# Altium project Project.PrjPCB
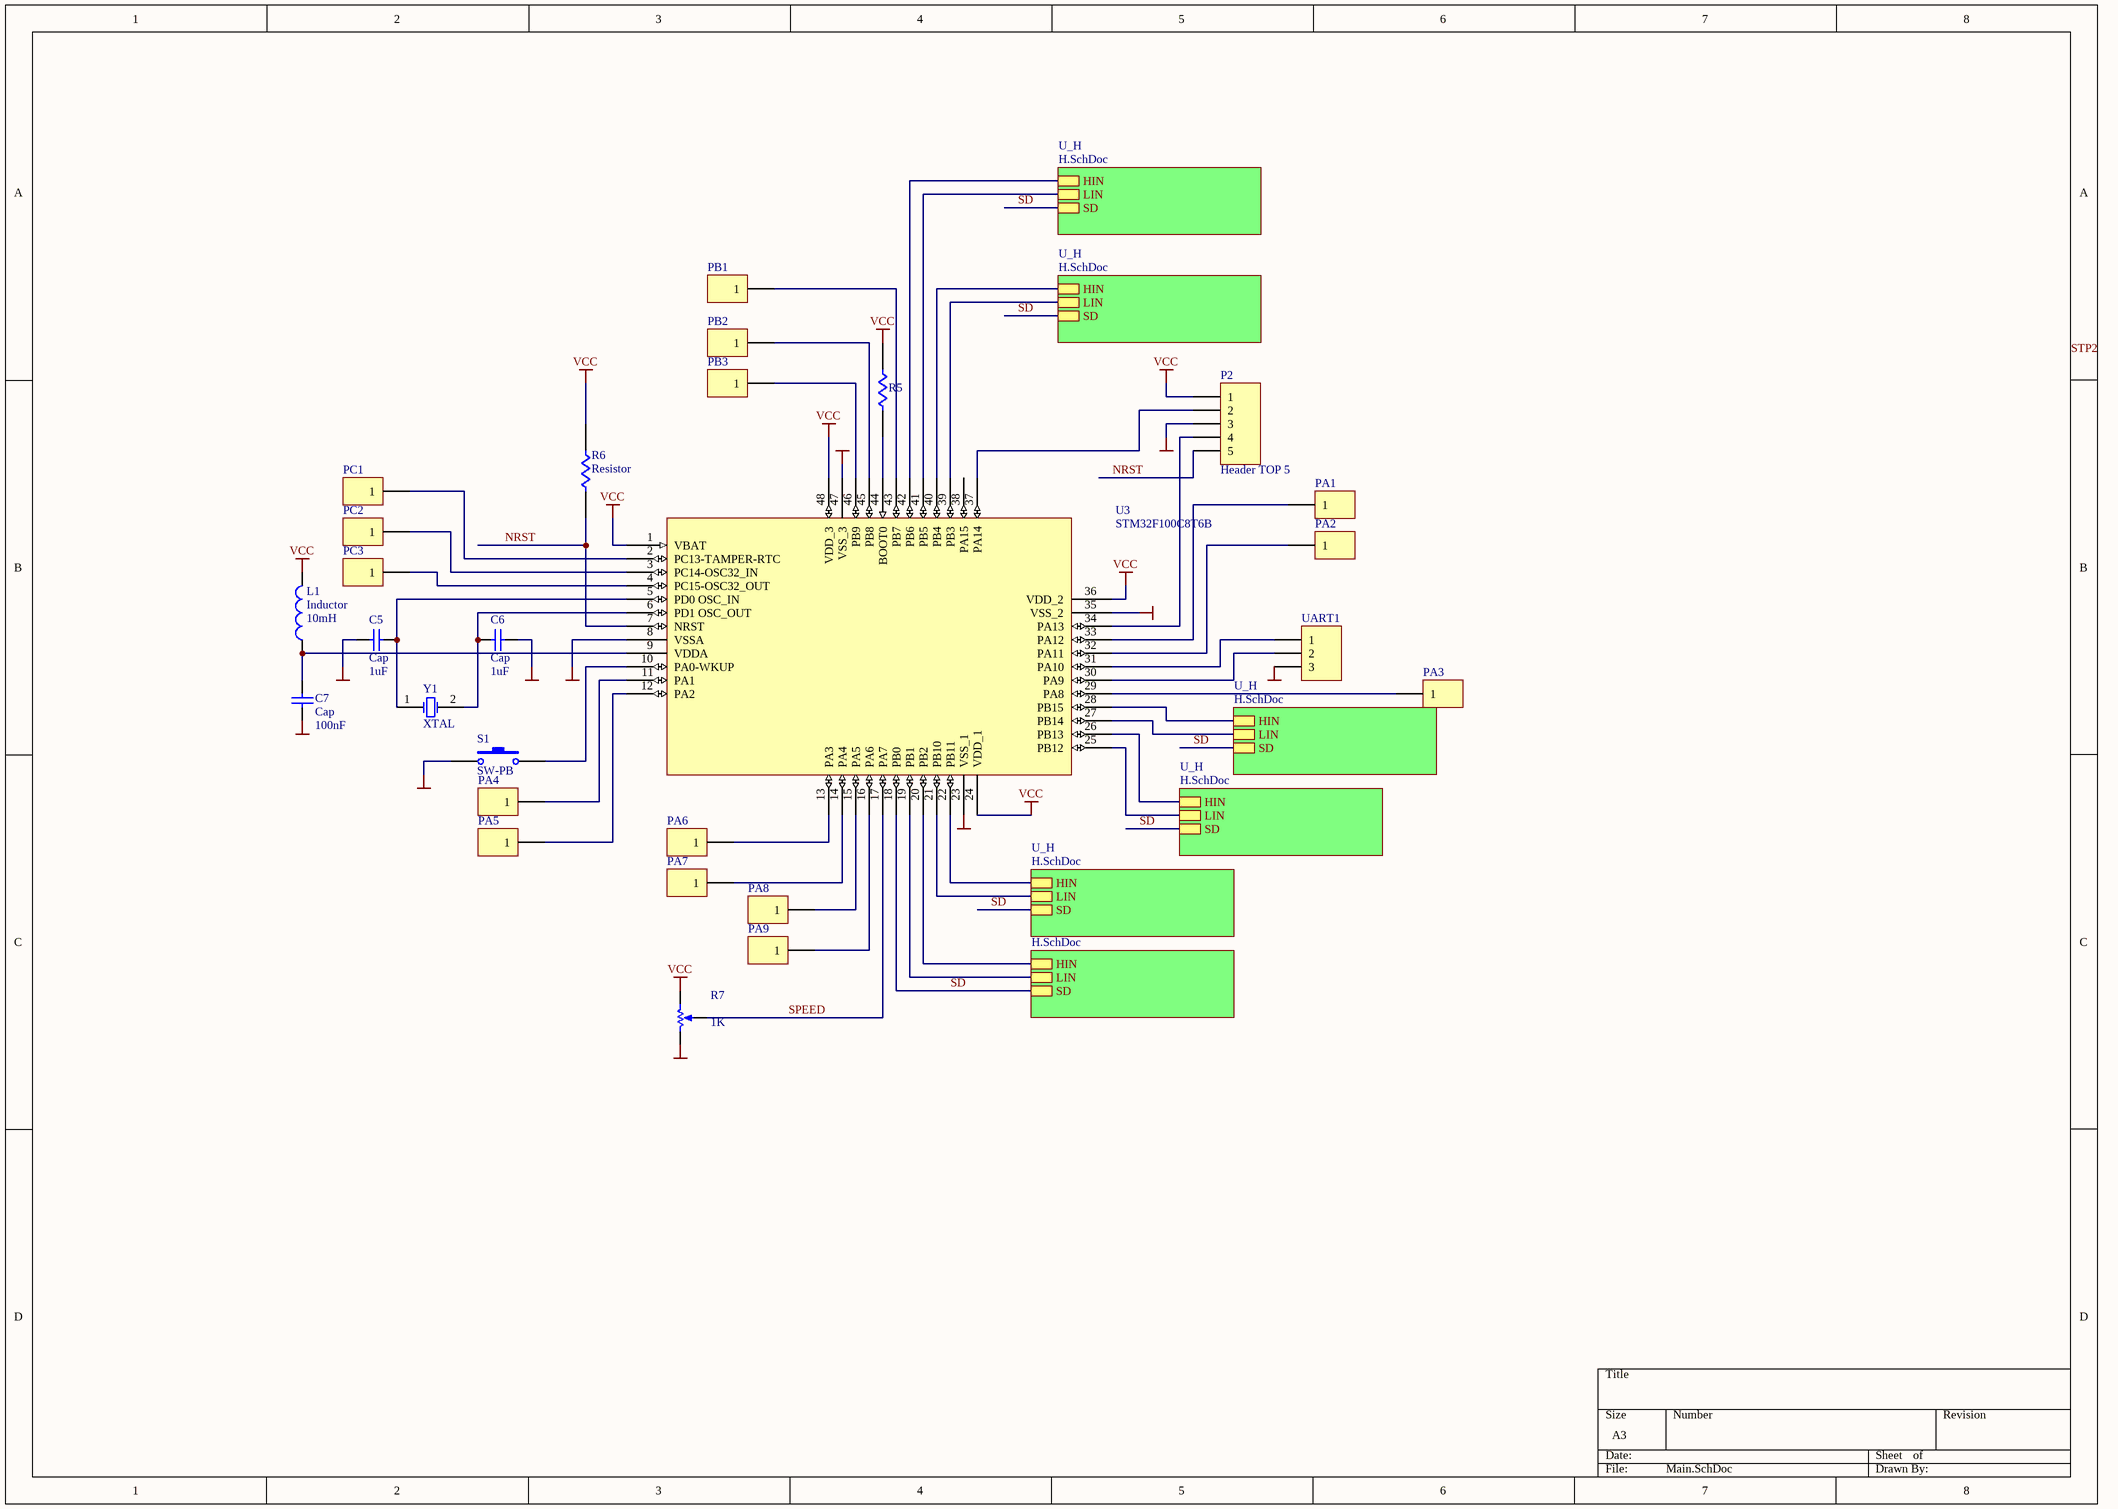
[diagram p0: Main.SchDoc]
3 sheets, 101 parts. Net scope: hierarchical (ports join the sheet entries above them; power ports are global).
Board file: PCB1.PcbDoc
Sheets:
  Main.SchDoc
    U_H = H.SchDoc
    U_H = H.SchDoc
    U_H = H.SchDoc
    U_H = H.SchDoc
    U_H = H.SchDoc
    U_H = H.SchDoc
  Pwr.SchDoc

## Sheet Main.SchDoc
size A3; PageSetup: Record=PageOptions|CenterHorizontal=True|CenterVertical=True|PrintScale=1.47|XCorrection=1.00|YCorrection=1.00|PrintKind=1|BorderSize=5000000|LeftOffset=0|BottomOffset=0|Orientation=2|PaperLength=1000|PaperWidth=1000|Scale=100|PaperSource=7|PrintQuality=-4|MediaType=1|DitherType=10|PrintScaleMode=1|PaperKind=A2 420 x 594 мм

### Parts
C5  Cap  value 1uF  [6-0805_M]
C6  Cap  value 1uF  [6-0805_M]
C7  Cap  value 100nF  [6-0805_M]
L1  Inductor  value 10mH  [INDC4532]
P2  Header TOP 5  [PIN_TOP_SMALL_5]
PA1  Header TOP 1  [PIN1]  (value not drawn)
PA2  Header TOP 1  [PIN1]  (value not drawn)
PA3  Header TOP 1  [PIN1]  (value not drawn)
PA4  Header TOP 1  [PIN1]  (value not drawn)
PA5  Header TOP 1  [PIN1]  (value not drawn)
PA6  Header TOP 1  [PIN1]  (value not drawn)
PA7  Header TOP 1  [PIN1]  (value not drawn)
PA8  Header TOP 1  [PIN1]  (value not drawn)
PA9  Header TOP 1  [PIN1]  (value not drawn)
PB1  Header TOP 1  [PIN1]  (value not drawn)
PB2  Header TOP 1  [PIN1]  (value not drawn)
PB3  Header TOP 1  [PIN1]  (value not drawn)
PC1  Header TOP 1  [PIN1]  (value not drawn)
PC2  Header TOP 1  [PIN1]  (value not drawn)
PC3  Header TOP 1  [PIN1]  (value not drawn)
R5  Resistor  [6-0805_M]  (value not drawn)
R6  Resistor  [6-0805_M]
R7  value 1K  [VR5]  (hidden comment: RPot)
S1  SW-PB  [SPST-2]
U3  STM32F100C8T6B  [TQFP48_L]
UART1  Header TOP 3  [PIN_TOP_SMALL_3]  (value not drawn)
Y1  XTAL  [RAD-0.3]

### Sub-sheets
U_H = H.SchDoc: HIN, LIN, SD
U_H = H.SchDoc: HIN, LIN, SD
U_H = H.SchDoc: HIN, LIN, SD
U_H = H.SchDoc: HIN, LIN, SD
U_H = H.SchDoc: HIN, LIN, SD
U_H = H.SchDoc: HIN, LIN, SD

### Nets
GND: C5.2 C6.1 C7.1 P2.3 R7.2(BOT) S1.1 U3.8(VSSA) U3.23(VSS_1) U3.35(VSS_2) U3.47(VSS_3) UART1.3
VCC: L1.2 P2.1 R5.2 R6.1 R7.1(TOP) U3.1(VBAT) U3.24(VDD_1) U3.36(VDD_2) U3.48(VDD_3)
NRST: P2.5 R6.2 U3.7(NRST)
SD: U3.18(PB0) ; sheet U_H/SD, sheet U_H/SD, sheet U_H/SD, sheet U_H/SD, sheet U_H/SD, sheet U_H/SD
SPEED: R7.3(TAP) U3.17(PA7)
NetC5_1: C5.1 U3.5(PD0_OSC_IN) Y1.1(OSC1)
NetC6_2: C6.2 U3.6(PD1_OSC_OUT) Y1.2(OSC2)
NetC7_2: C7.2 L1.1 U3.9(VDDA)
NetP2_2: P2.2 U3.37(PA14)
NetP2_4: P2.4 U3.34(PA13)
NetPA1_1: PA1.1 U3.33(PA12)
NetPA2_1: PA2.1 U3.32(PA11)
NetPA3_1: PA3.1 U3.29(PA8)
NetPA4_1: PA4.1 U3.11(PA1)
NetPA5_1: PA5.1 U3.12(PA2)
NetPA6_1: PA6.1 U3.13(PA3)
NetPA7_1: PA7.1 U3.14(PA4)
NetPA8_1: PA8.1 U3.15(PA5)
NetPA9_1: PA9.1 U3.16(PA6)
NetPB1_1: PB1.1 U3.43(PB7)
NetPB2_1: PB2.1 U3.45(PB8)
NetPB3_1: PB3.1 U3.46(PB9)
NetPC1_1: PC1.1 U3.2(PC13-TAMPER-RTC)
NetPC2_1: PC2.1 U3.3(PC14-OSC32_IN)
NetPC3_1: PC3.1 U3.4(PC15-OSC32_OUT)
NetR5_1: R5.1 U3.44(BOOT0)
NetS1_2: S1.2 U3.10(PA0-WKUP)
NetU2_U_H#1_12: U3.20(PB2) ; sheet U_H/HIN
NetU2_U_H#1_14: U3.19(PB1) ; sheet U_H/LIN
NetU2_U_H#2_12: U3.26(PB13) ; sheet U_H/HIN
NetU2_U_H#2_14: U3.25(PB12) ; sheet U_H/LIN
NetU2_U_H#3_12: U3.28(PB15) ; sheet U_H/HIN
NetU2_U_H#3_14: U3.27(PB14) ; sheet U_H/LIN
NetU2_U_H#4_12: U3.22(PB11) ; sheet U_H/HIN
NetU2_U_H#4_14: U3.21(PB10) ; sheet U_H/LIN
NetU2_U_H#5_12: U3.40(PB4) ; sheet U_H/HIN
NetU2_U_H#5_14: U3.39(PB3) ; sheet U_H/LIN
NetU2_U_H#6_12: U3.42(PB6) ; sheet U_H/HIN
NetU2_U_H#6_14: U3.41(PB5) ; sheet U_H/LIN
NetU3_30: U3.30(PA9) UART1.2
NetU3_31: U3.31(PA10) UART1.1

Not connected (* = marked no-connect by the designer): U3 38(PA15)

### Notes on the sheet
- Labels drawn without touching a wire or pin: STP2

### Library data of the parts
C5-C7 = Cap: Capacitor; Published: 8-Jun-2000; LatestRevisionDate: 17-Jul-2002; LatestRevisionNote: Re-released for DXP Platform.; PackageReference: RAD-0.3; Publisher: Altium Limited; PackageDescription: Radial Cap, Thru-Hole; 2 Leads; 0.3 in Pin Spacing
L1 = Inductor: Code_IEC: 1005; Published: 8-Jun-2000; LatestRevisionDate: 29-May-2009; LatestRevisionNote: IPC-7351 Footprint Added.; PackageReference: 0402-A; Publisher: Altium Limited; PackageDescription: Chip Inductor; Code_JEITA: 0402
P2 = Header TOP 5: Header, 1Pin; LatestRevisionDate: 17-Jul-2002; LatestRevisionNote: Re-released for DXP Platform.; Publisher: Altium Limited
PA1-PA9 PB1-PB3 PC1-PC3 = Header TOP 1: Header, 1Pin; LatestRevisionDate: 17-Jul-2002; LatestRevisionNote: Re-released for DXP Platform.; Publisher: Altium Limited
R7 = RPot: Potentiometer; Sim Note: Enter the Resistance value and the set point into parameter fields.; Set Position: 0.5; Published: 8-Jun-2000; LatestRevisionDate: 17-Jul-2002; LatestRevisionNote: Re-released for DXP Platform.; PackageReference: VR5; Publisher: Altium Limited; PackageDescription: Variable Resistor, Thru-Hole; 3 Leads
S1 = SW-PB: Switch; Published: 24-Mar-1999; LatestRevisionDate: 17-Jul-2002; LatestRevisionNote: Re-released for DXP Platform.; PackageReference: SPST-2; Publisher: Altium Limited; PackageDescription: Switch; 2 Leads
U3 = STM32F100C8T6B: STM32 ARM-based 32-bit MCU with 32 Kbytes Flash, 48-pin LQFP, Industrial Temperature; Published: 30-May-2008; DatasheetVersion: rev6, Mar-2008; PackageVersion: Mar-2008; PackageReference: LQFP48; Publisher: Altium Limited; PackageDescription: 48-Pin Low-Profile Quad Flat Pack, 7 x 7 mm Body, 0.5 mm Pitch (LQFP48); ComponentLink1Description: Manufacturer Link; ComponentLink1URL: www.st.com/stm32; ComponentLink2Description: Datasheet; ComponentLink2URL: http://www.st.com/stonline/products/literature/ds/13586.pdf
UART1 = Header TOP 3: Header, 1Pin; LatestRevisionDate: 17-Jul-2002; LatestRevisionNote: Re-released for DXP Platform.; Publisher: Altium Limited
Y1 = XTAL: Crystal Oscillator; Published: 8-Jun-2000; LatestRevisionDate: 17-Jul-2002; LatestRevisionNote: Re-released for DXP Platform.; PackageReference: R38; Publisher: Altium Limited; PackageDescription: Crystal, Thru-Hole; 2 Leads; Body 3.1 x 8.2 mm (Dia.xH)
R5 R6 = Resistor: Published: 24-Mar-1999; LatestRevisionDate: 29-May-2009; LatestRevisionNote: IPC-7351 Footprint Added.; PackageVersion: Mar-2003; PackageReference: 6-0805; Publisher: Altium Limited; PackageDescription: Chip Resistor 0805 Case Size; Code_IPC: RESC2012

## Sheet H.SchDoc
size A4
Used 6 times, as channels U_H, U_H, U_H, U_H, U_H, U_H. Parts and nets are listed once, with the designators drawn on the sheet.
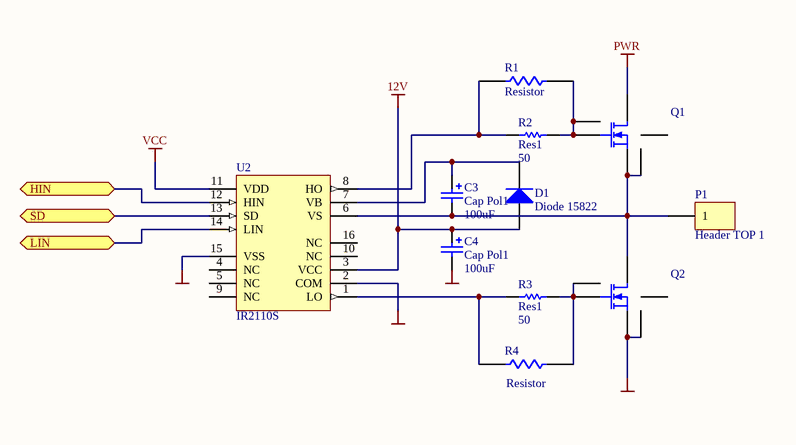
[diagram p1: H.SchDoc]

### Parts
C3  Cap Pol1  value 100uF  [CAPR-Small]
C4  Cap Pol1  value 100uF  [CAPR-Small]
D1  Diode 15822  [DO-35]
P1  Header TOP 1  [PIN1]
Q1  NMOSFET-UNIVERSAL  [NMOSFET-UNIVERSAL]  (value not drawn)
Q2  NMOSFET-UNIVERSAL  [NMOSFET-UNIVERSAL]  (value not drawn)
R1  Resistor  [6-0805_M]
R2  Res1  value 50  [AXIAL-0.3]
R3  Res1  value 50  [AXIAL-0.3]
R4  Resistor  [6-0805_M]
U2  IR2110S  [SOIC16_N]

### Ports
HIN, LIN, SD

### Nets
12V: C4.1 D1.1(A) U2.3(VCC)
GND: C4.2 Q2.3(S) Q2.5 U2.2(COM) U2.15(VSS)
PWR: Q1.2(D)
VCC: U2.11(VDD)
HIN: U2.12(HIN) ; port HIN
LIN: U2.14(LIN) ; port LIN
SD: U2.13(SD) ; port SD
NetC3_1: C3.1 D1.2(K) U2.7(VB)
NetC3_2: C3.2 P1.1 Q1.3(S) Q1.5 Q2.2(D) U2.6(VS)
NetQ1_1: Q1.1(G) Q1.4 R1.1 R2.2
NetQ2_1: Q2.1(G) Q2.4 R3.2 R4.1
NetR1_2: R1.2 R2.1 U2.8(HO)
NetR3_1: R3.1 R4.2 U2.1(LO)

Not connected (* = marked no-connect by the designer): Q1 6; Q2 6; U2 4(NC) 5(NC) 9(NC) 10(NC) 16(NC)

### Channels
U_H: designators end in _U_H#1; ports HIN=NetU2_U_H#1_12 LIN=NetU2_U_H#1_14 SD=SD
U_H: designators end in _U_H#2; ports HIN=NetU2_U_H#2_12 LIN=NetU2_U_H#2_14 SD=SD
U_H: designators end in _U_H#3; ports HIN=NetU2_U_H#3_12 LIN=NetU2_U_H#3_14 SD=SD
U_H: designators end in _U_H#4; ports HIN=NetU2_U_H#4_12 LIN=NetU2_U_H#4_14 SD=SD
U_H: designators end in _U_H#5; ports HIN=NetU2_U_H#5_12 LIN=NetU2_U_H#5_14 SD=SD
U_H: designators end in _U_H#6; ports HIN=NetU2_U_H#6_12 LIN=NetU2_U_H#6_14 SD=SD

### Library data of the parts
C3 C4 = Cap Pol1: Polarized Capacitor (Radial); Published: 8-Jun-2000; LatestRevisionDate: 17-Jul-2002; LatestRevisionNote: Re-released for DXP Platform.; PackageReference: RB7.6-15; Publisher: Altium Limited; PackageDescription: Polarized Capacitor (Radial); 2 Leads
D1 = Diode 1N4448: High Conductance Fast Diode; Published: 8-Jun-2000; LatestRevisionDate: 17-Jul-2002; LatestRevisionNote: Re-released for DXP Platform.; DatasheetVersion: 1997; PackageReference: DO-35; Publisher: Altium Limited; PackageDescription: Diode, Axial; Body 3.8 x 1.9 mm (LxDia. max), Lead Dia. 0.53 mm (max); Code_JEDEC: DO-204-AH; ComponentLink1Description: Manufacturer Link; ComponentLink1URL: http://www.fairchildsemi.com/; ComponentLink2Description: Datasheet; ComponentLink2URL: http://www.fairchildsemi.com/ds/1N%2F1N4448.pdf
P1 = Header TOP 1: Header, 1Pin; LatestRevisionDate: 17-Jul-2002; LatestRevisionNote: Re-released for DXP Platform.; Publisher: Altium Limited
Q1 Q2 = NMOSFET-UNIVERSAL: N-Channel MOSFET; Published: 8-Jun-2000; LatestRevisionDate: 17-Jul-2002; LatestRevisionNote: Re-released for DXP Platform.; PackageVersion: 1995/1996; PackageReference: E3; Publisher: Altium Limited; PackageDescription: TO, Flat Index; 3 In-Line, Axial Leads; Body Dia. 4.6mm; Lead Dia. 0.5 mm (max)
R2 R3 = Res1: Resistor; Published: 8-Jun-2000; LatestRevisionDate: 17-Jul-2002; LatestRevisionNote: Re-released for DXP Platform.; PackageReference: AXIAL-0.3; Publisher: Altium Limited; PackageDescription: Axial Device, Thru-Hole; 2 Leads; 0.3 in Pin Spacing
U2 = IR2110S: High and Low Side Driver; Note: Pins 4, 5, 9, 10 and 16 are not connected; Published: 8-Jun-2000; LatestRevisionDate: 13-Apr-2006; LatestRevisionNote: IPC-7351 Footprint Added.; DatasheetVersion: PD60147J; PackageReference: SOIC16; Publisher: Altium Limited; PackageDescription: 16-Pin Small Outline Integrated Circuit 1.27 mm Pitch; Code_JEDEC: MS-013-AA; Code_IPC: SOIC127P1030-16; ComponentLink1Description: Manufacturer Link; ComponentLink1URL: http://www.irf.com/; ComponentLink2Description: Datasheet; ComponentLink2URL: http://www.irf.com/product-info/datasheets/data/ir2110.pdf
R1 R4 = Resistor: Published: 24-Mar-1999; LatestRevisionDate: 29-May-2009; LatestRevisionNote: IPC-7351 Footprint Added.; PackageVersion: Mar-2003; PackageReference: 6-0805; Publisher: Altium Limited; PackageDescription: Chip Resistor 0805 Case Size; Code_IPC: RESC2012

## Sheet Pwr.SchDoc
size A4
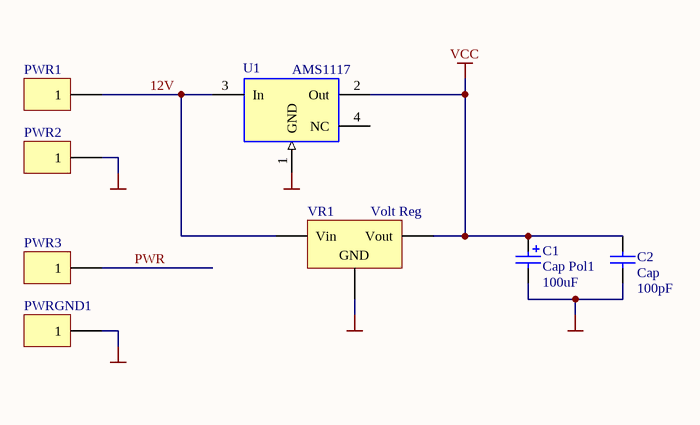
[diagram p2: Pwr.SchDoc]

### Parts
C1  Cap Pol1  value 100uF  [RAD-0.3]
C2  Cap  value 100pF  [RAD-0.3]
PWR1  Header TOP 1  [PIN1]  (value not drawn)
PWR2  Header TOP 1  [PIN1]  (value not drawn)
PWR3  Header TOP 1  [PIN1]  (value not drawn)
PWRGND1  Header TOP 1  [PIN1]  (value not drawn)
U1  AMS1117  [SOT223_M]
VR1  Volt Reg  [D2PAK_N]

### Nets
GND: C1.2 C2.1 PWR2.1 PWRGND1.1 U1.1(GND) VR1.2(GND)
VCC: C1.1 C2.2 U1.2(Out) VR1.3(Vout)
12V: PWR1.1 U1.3(In) VR1.1(Vin)
PWR: PWR3.1

Not connected (* = marked no-connect by the designer): U1 4(NC)

### Library data of the parts
C1 = Cap Pol1: Polarized Capacitor (Radial); Published: 8-Jun-2000; LatestRevisionDate: 17-Jul-2002; LatestRevisionNote: Re-released for DXP Platform.; PackageReference: RB7.6-15; Publisher: Altium Limited; PackageDescription: Polarized Capacitor (Radial); 2 Leads
C2 = Cap: Capacitor; Published: 8-Jun-2000; LatestRevisionDate: 17-Jul-2002; LatestRevisionNote: Re-released for DXP Platform.; PackageReference: RAD-0.3; Publisher: Altium Limited; PackageDescription: Radial Cap, Thru-Hole; 2 Leads; 0.3 in Pin Spacing
PWR1-PWR3 PWRGND1 = Header TOP 1: Header, 1Pin; LatestRevisionDate: 17-Jul-2002; LatestRevisionNote: Re-released for DXP Platform.; Publisher: Altium Limited
U1 = AMS1117: VOLTAGE REGULATOR; Published: 24-Mar-1999; LatestRevisionDate: 17-Jul-2002; LatestRevisionNote: Re-released for DXP Platform.; PackageReference: DIP-6; Publisher: Altium Limited; Code_JEDEC: MO-001-AM
VR1 = Volt Reg: Voltage Regulator; Published: 24-Mar-1999; LatestRevisionDate: 29-May-2009; LatestRevisionNote: IPC-7351 Footprint Added.; PackageReference: D2PAK; Publisher: Altium Limited; PackageDescription: 3-Pin Transistor Outline Package 2.54 mm Pitch, 15.1 mm Lead Span

## Nets that join several sheets
12V: U_H (C4_U_H#1.1 D1_U_H#1.1 U2_U_H#1.3), U_H (C4_U_H#2.1 D1_U_H#2.1 U2_U_H#2.3), U_H (C4_U_H#3.1 D1_U_H#3.1 U2_U_H#3.3), U_H (C4_U_H#4.1 D1_U_H#4.1 U2_U_H#4.3), U_H (C4_U_H#5.1 D1_U_H#5.1 U2_U_H#5.3), U_H (C4_U_H#6.1 D1_U_H#6.1 U2_U_H#6.3)
GND: Main (11 pins), U_H (5 pins), U_H (5 pins), U_H (5 pins), U_H (5 pins), U_H (5 pins), U_H (5 pins), Pwr (6 pins)
PWR: U_H (Q1_U_H#1.2), U_H (Q1_U_H#2.2), U_H (Q1_U_H#3.2), U_H (Q1_U_H#4.2), U_H (Q1_U_H#5.2), U_H (Q1_U_H#6.2)
VCC: Main (9 pins), U_H (U2_U_H#1.11), U_H (U2_U_H#2.11), U_H (U2_U_H#3.11), U_H (U2_U_H#4.11), U_H (U2_U_H#5.11), U_H (U2_U_H#6.11), Pwr (C1.1 C2.2 U1.2 VR1.3)
NetU2_U_H#1_12: Main (U3.20), U_H (U2_U_H#1.12)
NetU2_U_H#1_14: Main (U3.19), U_H (U2_U_H#1.14)
NetU2_U_H#2_12: Main (U3.26), U_H (U2_U_H#2.12)
NetU2_U_H#2_14: Main (U3.25), U_H (U2_U_H#2.14)
NetU2_U_H#3_12: Main (U3.28), U_H (U2_U_H#3.12)
NetU2_U_H#3_14: Main (U3.27), U_H (U2_U_H#3.14)
NetU2_U_H#4_12: Main (U3.22), U_H (U2_U_H#4.12)
NetU2_U_H#4_14: Main (U3.21), U_H (U2_U_H#4.14)
NetU2_U_H#5_12: Main (U3.40), U_H (U2_U_H#5.12)
NetU2_U_H#5_14: Main (U3.39), U_H (U2_U_H#5.14)
NetU2_U_H#6_12: Main (U3.42), U_H (U2_U_H#6.12)
NetU2_U_H#6_14: Main (U3.41), U_H (U2_U_H#6.14)
SD: Main (U3.18), U_H (U2_U_H#1.13), U_H (U2_U_H#2.13), U_H (U2_U_H#3.13), U_H (U2_U_H#4.13), U_H (U2_U_H#5.13), U_H (U2_U_H#6.13)